# EAGLE schematic ridicideskaV4 (EAGLE 7.2.0)
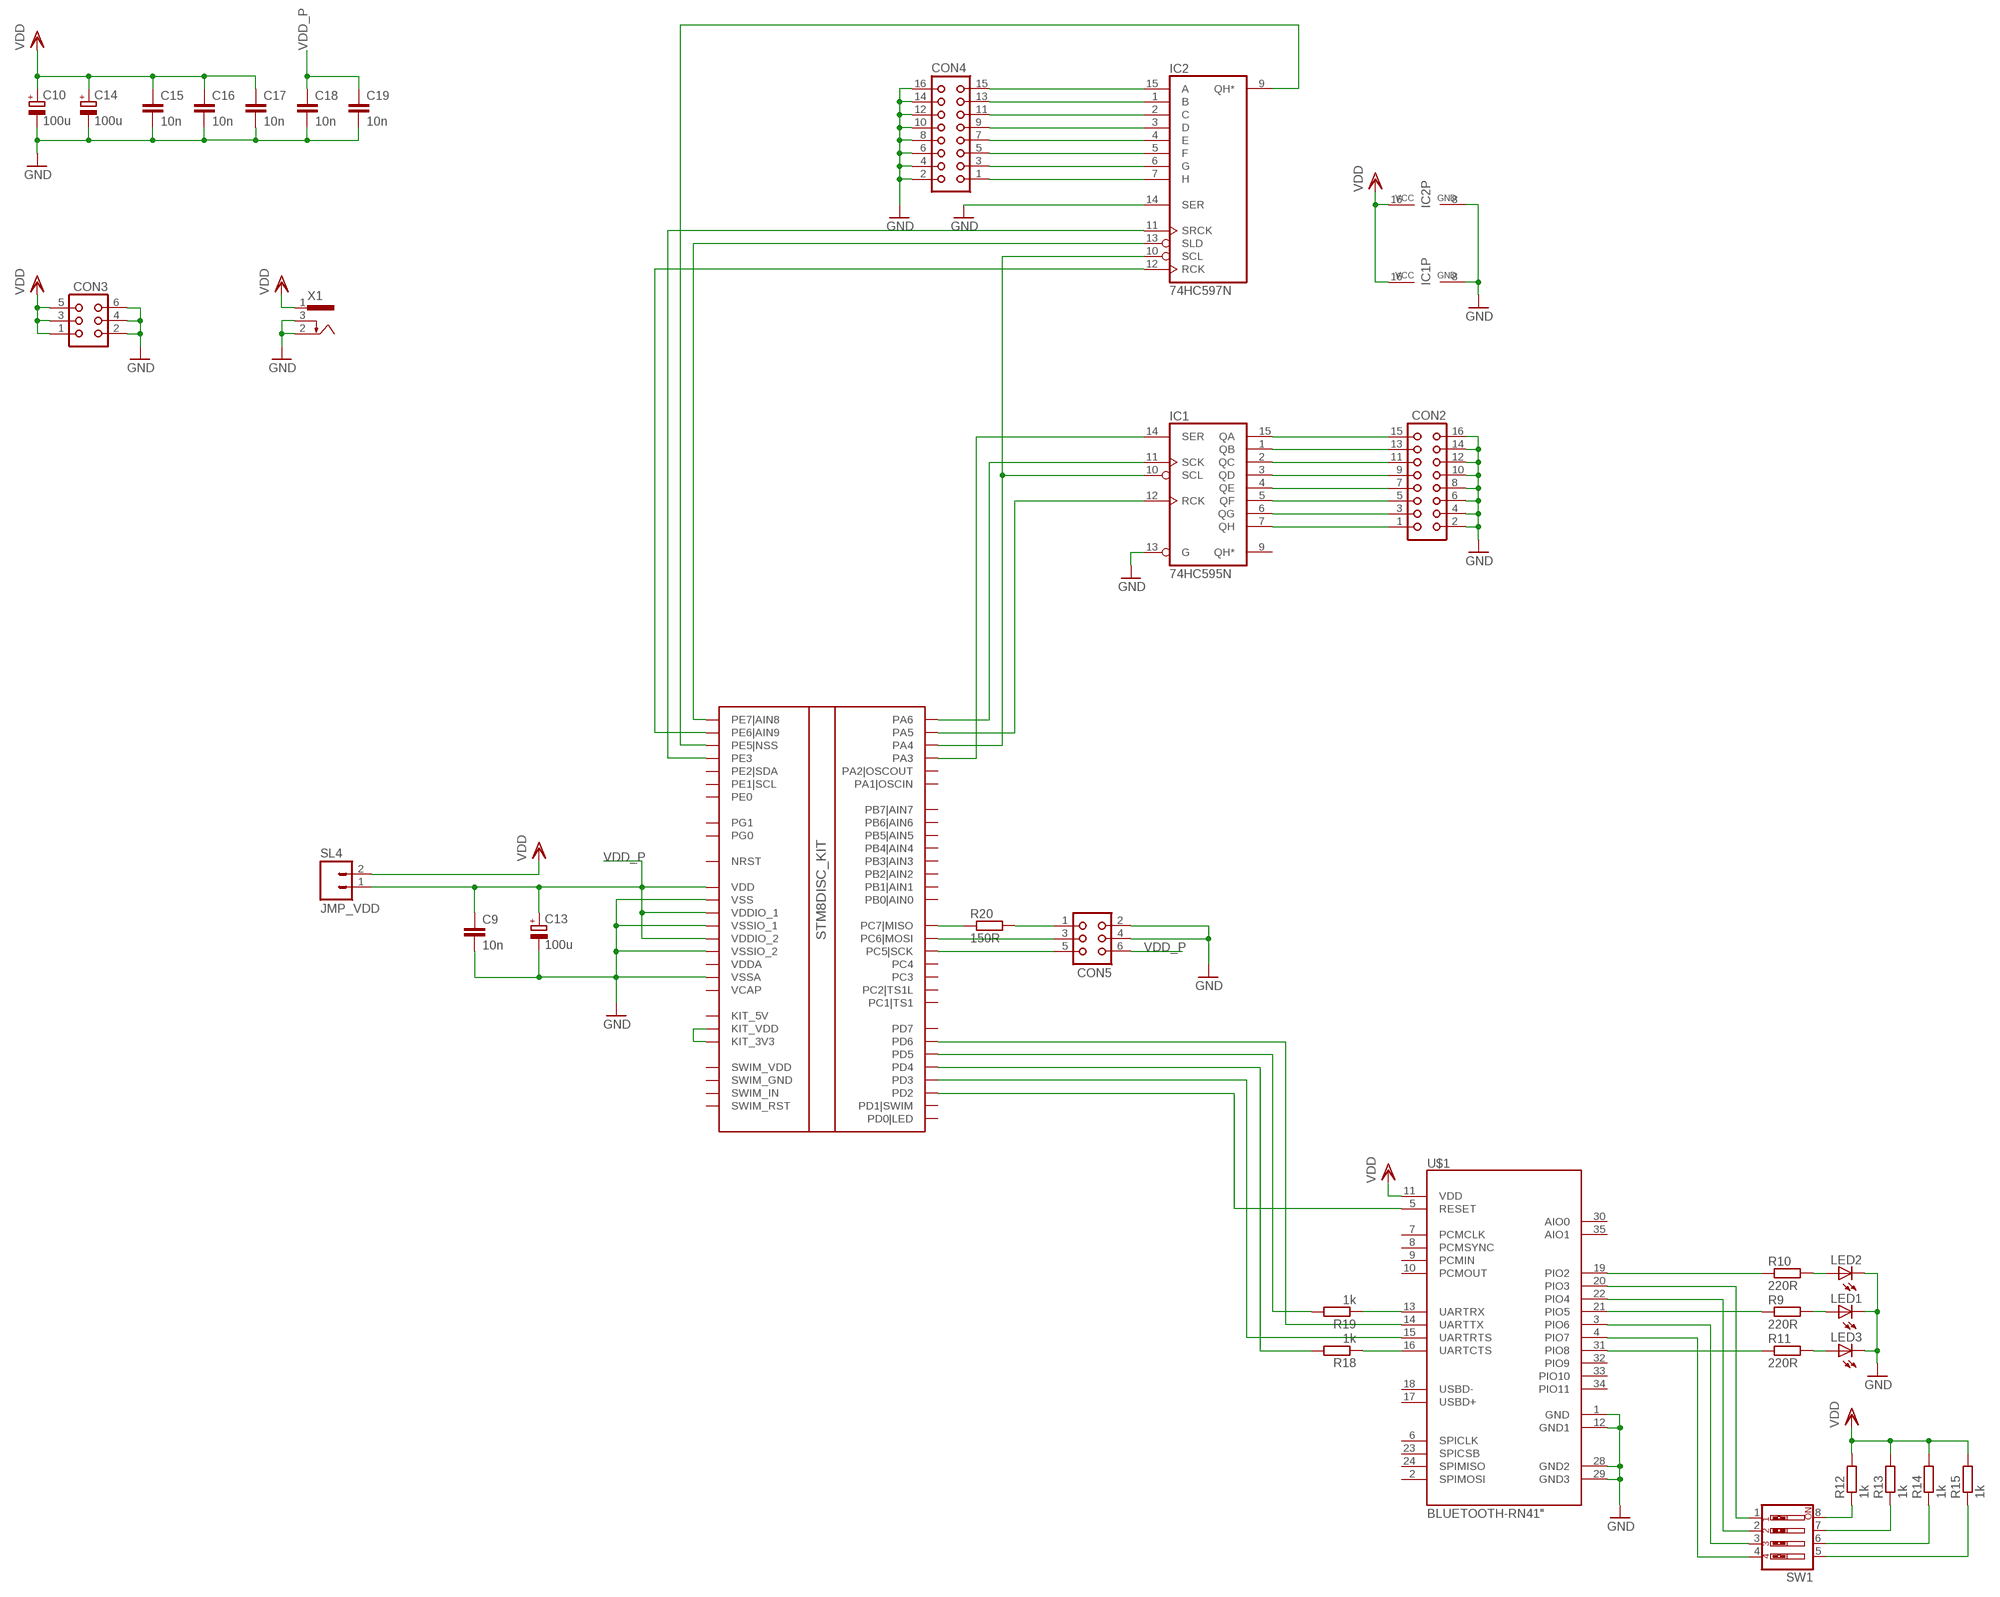
[diagram p0: schematic, sheet 1, part 1 of 2]
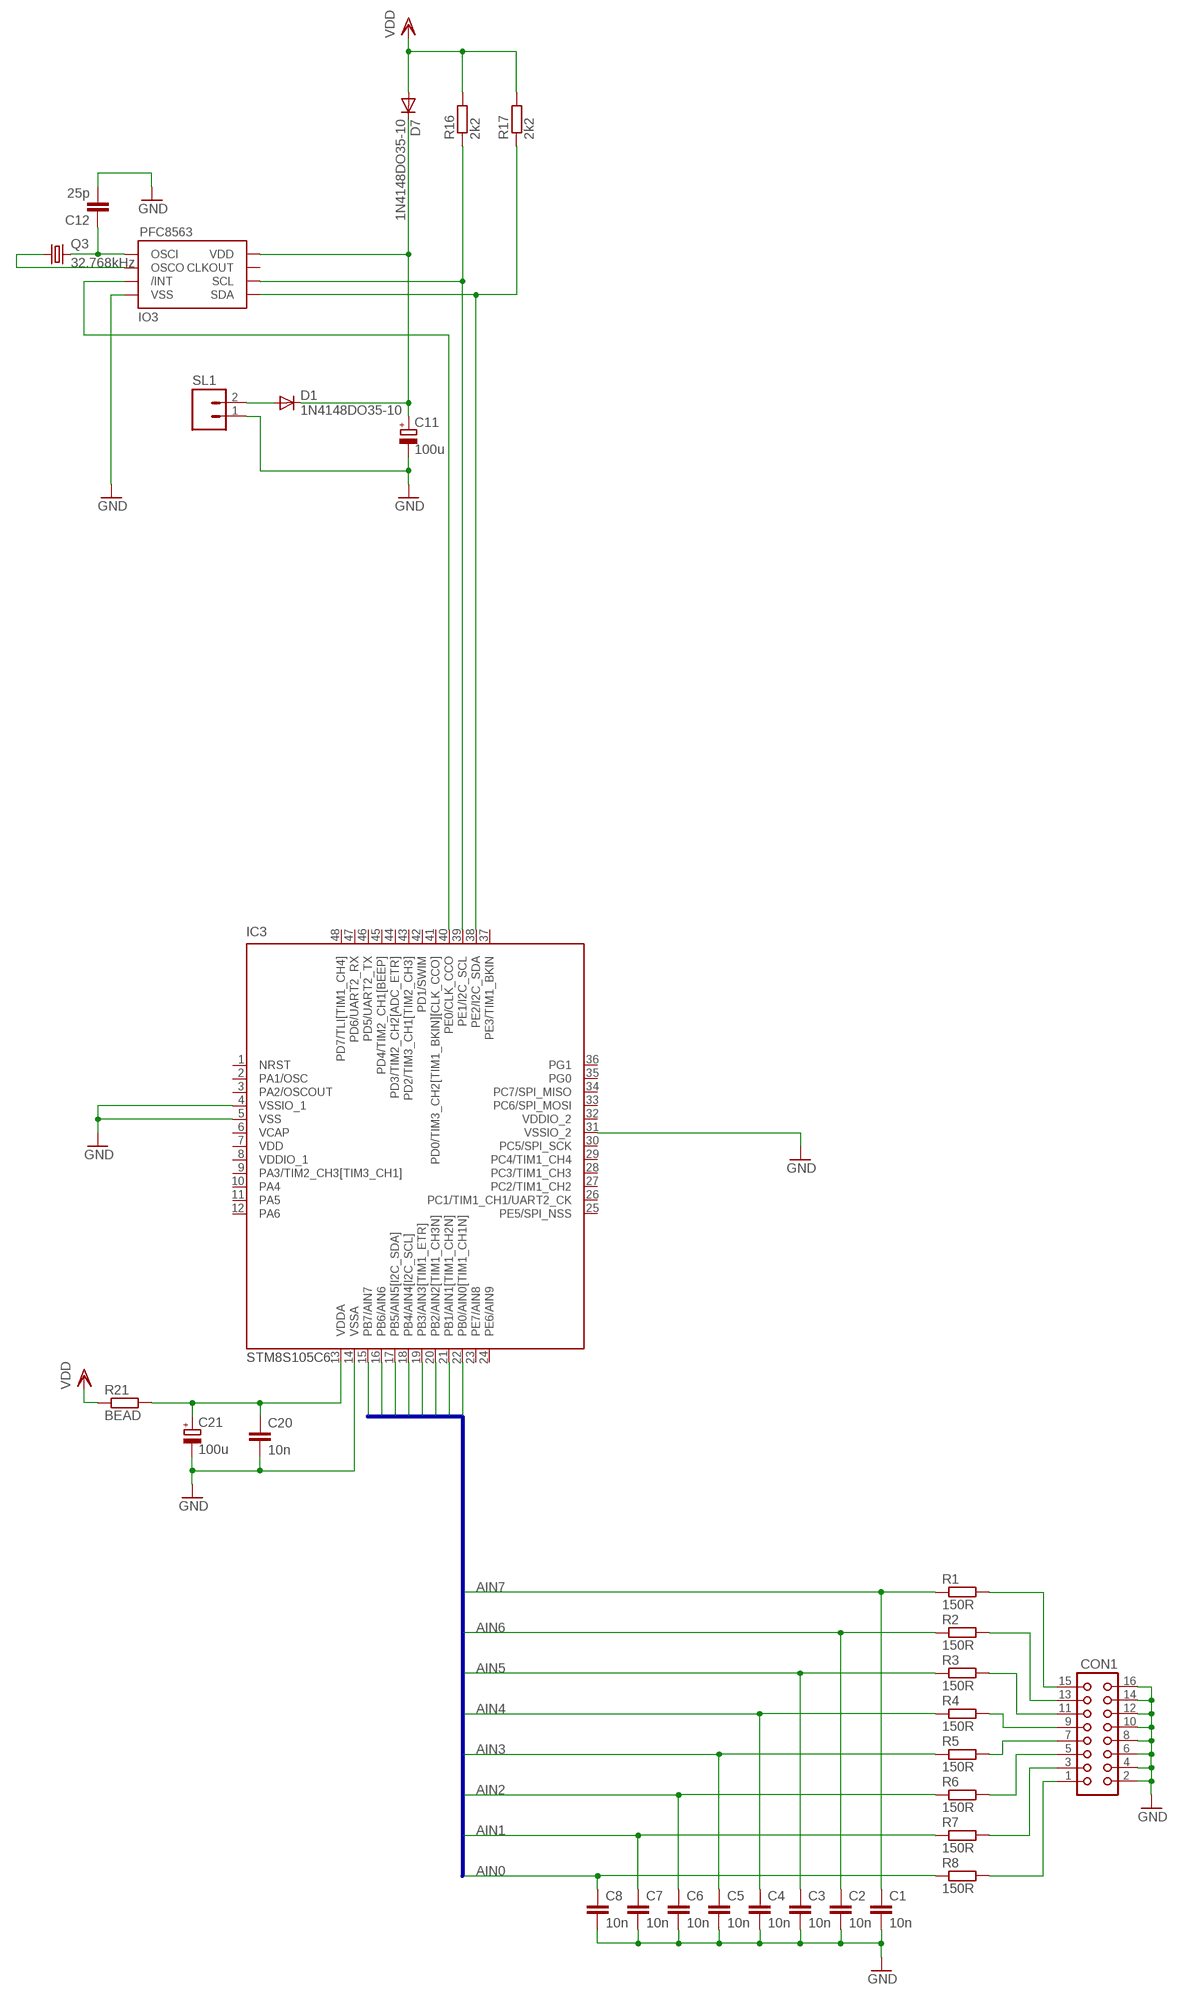
[diagram p1: schematic, sheet 1, part 2 of 2]

## Parts
C1  10n  C-EUC0805  [C0805]
C2  10n  C-EUC0805  [C0805]
C3  10n  C-EUC0805  [C0805]
C4  10n  C-EUC0805  [C0805]
C5  10n  C-EUC0805  [C0805]
C6  10n  C-EUC0805  [C0805]
C7  10n  C-EUC0805  [C0805]
C8  10n  C-EUC0805  [C0805]
C9  10n  C-EU050-045X075  [C050-045X075]
C10  100u  CPOL-EUE5-10.5  [E5-10,5]
C11  100u  CPOL-EUE5-10.5  [E5-10,5]
C12  25p  C-EUC0603  [C0603]
C13  100u  CPOL-EUE5-10.5  [E5-10,5]
C14  100u  CPOL-EUE5-10.5  [E5-10,5]
C15  10n  C-EU050-045X075  [C050-045X075]
C16  10n  C-EU050-045X075  [C050-045X075]
C17  10n  C-EUC0805  [C0805]
C18  10n  C-EUC0805  [C0805]
C19  10n  C-EUC0805  [C0805]
C20  10n  C-EUC0805  [C0805]
C21  100u  CPOL-EUSMCC  [SMC_C]
CON1  CON16  [CON16]
CON2  CON16  [CON16]
CON3  CON06  [CON06]
CON4  CON16  [CON16]
CON5  CON06  [CON06]
D1  1N4148DO35-10  [DO35-10]
D7  1N4148DO35-10  [DO35-10]
IC1  74HC595N  [DIL16]
IC2  74HC597N  [DIL16]
IC3  STM8S105C6  [LQFP48-7X7]
IO1  STM8_KIT  [STM8SDISCOVERY]
IO3  PFC8563  [SO08]
LED1  LED3MM  [LED3MM]
LED2  LED3MM  [LED3MM]
LED3  LED3MM  [LED3MM]
Q3  32.768kHz  CRYSTALTC26V  [TC26V]
R1  150R  R-EU_0207/12  [0207/12]
R2  150R  R-EU_0207/12  [0207/12]
R3  150R  R-EU_0207/12  [0207/12]
R4  150R  R-EU_0207/12  [0207/12]
R5  150R  R-EU_0207/12  [0207/12]
R6  150R  R-EU_0207/12  [0207/12]
R7  150R  R-EU_0207/12  [0207/12]
R8  150R  R-EU_0207/12  [0207/12]
R9  220R  R-EU_0207/12  [0207/12]
R10  220R  R-EU_0207/12  [0207/12]
R11  220R  R-EU_0207/12  [0207/12]
R12  1k  R-EU_0207/12  [0207/12]
R13  1k  R-EU_0207/12  [0207/12]
R14  1k  R-EU_0207/12  [0207/12]
R15  1k  R-EU_0207/12  [0207/12]
R16  2k2  R-EU_0207/12  [0207/12]
R17  2k2  R-EU_0207/12  [0207/12]
R18  1k  R-EU_0207/12  [0207/12]
R19  1k  R-EU_0207/12  [0207/12]
R20  150R  R-EU_R0805  [R0805]
R21  BEAD  R-EU_R0805  [R0805]
SL1  M02  [02P]
SL4  JMP_VDD  M02  [02P]
SW1  SW_DIP-4  [EDG-04]
U$1  BLUETOOTH-RN41"  [RN41]
X1  733980-62  [733980-62]

## Nets
AIN0: C8.1 IC3.22(PB0/AIN0[TIM1_CH1N]) R8.1
AIN1: C7.1 IC3.21(PB1/AIN1[TIM1_CH2N]) R7.1
AIN2: C6.1 IC3.20(PB2/AIN2[TIM1_CH3N]) R6.1
AIN3: C5.1 IC3.19(PB3/AIN3[TIM1_ETR]) R5.1
AIN4: C4.1 IC3.18(PB4/AIN4[I2C_SCL]) R4.1
AIN5: C3.1 IC3.17(PB5/AIN5[I2C_SDA]) R3.1
AIN6: C2.1 IC3.16(PB6/AIN6) R2.1
AIN7: C1.1 IC3.15(PB7/AIN7) R1.1
GND: C1.2 C2.2 C3.2 C4.2 C5.2 C6.2 C7.2 C8.2 C9.2 C10.- C11.- C12.2 C13.- C14.- C15.2 C16.2 C17.2 C18.2 C19.2 C20.2 C21.- CON1.2 CON1.4 CON1.6 CON1.8 CON1.10 CON1.12 CON1.14 CON1.16 CON2.2 CON2.4 CON2.6 CON2.8 CON2.10 CON2.12 CON2.14 CON2.16 CON3.2 CON3.4 CON3.6 CON4.2 CON4.4 CON4.6 CON4.8 CON4.10 CON4.12 CON4.14 CON4.16 CON5.2 CON5.4 IC1.8(GND) IC1.13(G) IC2.8(GND) IC2.14(SER) IC3.4(VSSIO_1) IC3.5(VSS) IC3.14(VSSA) IC3.31(VSSIO_2) IO1.VSS IO1.VSSA IO1.VSSIO_1 IO1.VSSIO_2 IO3.4(VSS) LED1.K(C) LED2.K(C) LED3.K(C) SL1.1 U$1.1(GND) U$1.12(GND1) U$1.28(GND2) U$1.29(GND3) X1.2 X1.3
N$1: IC1.14(SER) IO1.PA3
N$2: D1.A SL1.2
N$3: C20.1 C21.+ IC3.13(VDDA) R21.2
N$6: CON1.15 R1.2
N$7: CON1.13 R2.2
N$8: CON1.11 R3.2
N$9: CON1.9 R4.2
N$10: CON1.1 R8.2
N$11: IC1.11(SCK) IO1.PA6
N$12: IC1.10(SCL) IC2.10(SCL) IO1.PA4
N$13: IC1.12(RCK) IO1.PA5
N$14: CON2.15 IC1.15(QA)
N$15: CON2.13 IC1.1(QB)
N$16: CON2.11 IC1.2(QC)
N$17: CON2.9 IC1.3(QD)
N$18: CON2.7 IC1.4(QE)
N$19: CON2.5 IC1.5(QF)
N$20: CON2.3 IC1.6(QG)
N$21: CON2.1 IC1.7(QH)
N$22: IC2.13(SLD) IO1.PE7(PE7|AIN8)
N$23: IC3.38(PE2/I2C_SDA) IO3.5(SDA) R17.1
N$24: IC2.9(QH*) IO1.PE5(PE5|NSS)
N$25: CON1.3 R7.2
N$28: IC3.39(PE1/I2C_SCL) IO3.6(SCL) R16.1
N$29: C11.+ D1.C D7.C IO3.8(VDD)
N$30: IC3.40(PE0/CLK_CCO) IO3.3(/INT)
N$31: CON4.15 IC2.15(A)
N$32: CON4.13 IC2.1(B)
N$33: CON4.11 IC2.2(C)
N$34: CON4.9 IC2.3(D)
N$35: CON4.7 IC2.4(E)
N$36: CON4.5 IC2.5(F)
N$37: CON4.3 IC2.6(G)
N$38: CON4.1 IC2.7(H)
N$39: C12.1 IO3.1(OSCI) Q3.2
N$40: IO3.2(OSCO) Q3.1
N$42: R19.1 U$1.13(UARTRX)
N$45: CON1.5 R6.2
N$46: CON1.7 R5.2
N$47: IO1.PD5 R19.2
N$48: IO1.PD6 U$1.14(UARTTX)
N$49: LED1.A R9.2
N$50: R9.1 U$1.21(PIO5)
N$51: R10.1 U$1.19(PIO2)
N$52: LED2.A R10.2
N$53: SW1.1 U$1.20(PIO3)
N$54: SW1.2 U$1.22(PIO4)
N$55: SW1.3 U$1.3(PIO6)
N$56: SW1.4 U$1.4(PIO7)
N$57: R11.1 U$1.31(PIO8)
N$58: LED3.A R11.2
N$59: R12.1 SW1.8
N$60: R13.1 SW1.7
N$61: R14.1 SW1.6
N$62: R15.1 SW1.5
N$63: IO1.PD4 R18.2
N$64: IO1.PD3 U$1.15(UARTRTS)
N$65: R18.1 U$1.16(UARTCTS)
N$66: IC2.12(RCK) IO1.PE6(PE6|AIN9)
N$67: IC2.11(SRCK) IO1.PE3
N$68: IO1.KIT_3V3 IO1.KIT_VDD
N$69: IO1.PD2 U$1.5(RESET)
N$70: IO1.PC7(PC7|MISO) R20.1
N$71: CON5.1 R20.2
N$72: CON5.3 IO1.PC6(PC6|MOSI)
N$73: CON5.5 IO1.PC5(PC5|SCK)
VDD: C10.+ C14.+ C15.1 C16.1 C17.1 CON3.1 CON3.3 CON3.5 D7.A IC1.16(VCC) IC2.16(VCC) R12.2 R13.2 R14.2 R15.2 R16.2 R17.2 R21.1 SL4.2 U$1.11(VDD) X1.1
VDD_P: C9.1 C13.+ C18.1 C19.1 CON5.6 IO1.VDD IO1.VDDIO_1 IO1.VDDIO_2 SL4.1
Unconnected: IC1.9(QH*) IC3.1(NRST) IC3.2(PA1/OSC) IC3.3(PA2/OSCOUT) IC3.9(PA3/TIM2_CH3[TIM3_CH1]) IC3.10(PA4) IC3.11(PA5) IC3.12(PA6) IC3.23(PE7/AIN8) IC3.24(PE6/AIN9) IC3.25(PE5/SPI_NSS) IC3.26(PC1/TIM1_CH1/UART2_CK) IC3.27(PC2/TIM1_CH2) IC3.28(PC3/TIM1_CH3) IC3.29(PC4/TIM1_CH4) IC3.30(PC5/SPI_SCK) IC3.33(PC6/SPI_MOSI) IC3.34(PC7/SPI_MISO) IC3.35(PG0) IC3.36(PG1) IC3.37(PE3/TIM1_BKIN) IC3.41(PD0/TIM3_CH2[TIM1_BKIN][CLK_CCO]) IC3.42(PD1/SWIM) IC3.43(PD2/TIM3_CH1[TIM2_CH3]) IC3.44(PD3/TIM2_CH2[ADC_ETR]) IC3.45(PD4/TIM2_CH1[BEEP]) IC3.46(PD5/UART2_TX) IC3.47(PD6/UART2_RX) IC3.48(PD7/TLI[TIM1_CH4]) IO1.KIT_5V IO1.NRST IO1.PA1(PA1|OSCIN) IO1.PA2(PA2|OSCOUT) IO1.PB0(PB0|AIN0) IO1.PB1(PB1|AIN1) IO1.PB2(PB2|AIN2) IO1.PB3(PB3|AIN3) IO1.PB4(PB4|AIN4) IO1.PB5(PB5|AIN5) IO1.PB6(PB6|AIN6) IO1.PB7(PB7|AIN7) IO1.PC1(PC1|TS1) IO1.PC2(PC2|TS1L) IO1.PC3 IO1.PC4 IO1.PD0(PD0|LED) IO1.PD1(PD1|SWIM) IO1.PD7 IO1.PE0 IO1.PE1(PE1|SCL) IO1.PE2(PE2|SDA) IO1.PG0 IO1.PG1 IO1.SWIM_GND IO1.SWIM_IN IO1.SWIM_RST IO1.SWIM_VDD IO1.VCAP IO1.VDDA IO3.7(CLKOUT) U$1.2(SPIMOSI) U$1.6(SPICLK) U$1.7(PCMCLK) U$1.8(PCMSYNC) U$1.9(PCMIN) U$1.10(PCMOUT) U$1.17(USBD+) U$1.18(USBD-) U$1.23(SPICSB) U$1.24(SPIMISO) U$1.30(AIO0) U$1.32(PIO9) U$1.33(PIO10) U$1.34(PIO11) U$1.35(AIO1)

## Buses
AIN[0..7]

## Power pins joined to a net without a drawn wire
VCAP: IC3.6(VCAP)
VDD: IC3.7(VDD)
VDDIO_1: IC3.8(VDDIO_1)
VDDIO_2: IC3.32(VDDIO_2)

## Library data of the parts
C1-C9 C12 C15-C20 = rcl:C-EU: CAPACITOR, European symbol
C10 C11 C13 C14 C21 = resistor:CPOL-EU: POLARIZED CAPACITOR, European symbol
CON1 CON2 CON4 = con-harting:CON16: CONNECTOR; OC_FARNELL: unknown; OC_NEWARK: unknown
CON3 CON5 = con-harting:CON06: CONNECTOR; OC_FARNELL: unknown; OC_NEWARK: unknown
D1 D7 = diode:1N4148: DIODE high speed (Philips)
IC1 = 74xx-eu:74*595: 8-bit SHIFT REGISTER, output latch
IC2 = 74xx-eu:74*597: 8-bit SHIFT REGISTER, input latch
IC3 = st-microelectronics:STM8S105C: Access line, 16 MHz STM8S 8-bit MCU up to 32 Kbytes Flash, integrated EEPROM,10-bit ADC, timers, UART, SPI, I²C Source: Data sheet <http://www.st.com/stonline/products/literature/ds/14771/stm8s105c4.pdf>; MPN: STM8S105C6T6; OC_FARNELL: 1706222; OC_NEWARK: 09R6033
IO1 = atypPouzdra:STM8_KIT
IO3 = atypPouzdra:PFC8563
LED1-LED3 = led:LED: LED OSRAM: - CHIPLED LG R971, LG N971, LY N971, LG Q971, LY Q971, LO R971, LY R971 LH N974, LH R974 LS Q976, LO Q976, LY Q976 LO Q996 - Hyper CHIPLED LW Q18S LB Q993, LB Q99A, LB R99A - SideLED LS A670, LO A670, LY A670, LG A670, LP A670 LB A673, LV A673, LT A673, LW A673 LH A674 LY A675 LS A676, LA A676, LO A676, LY A676, LW A676 LS A679, LY A679, LG A679 - Hyper Micro SIDELED® LS Y876, LA Y876, LO Y876, LY Y876 LT Y87S - SmartLED LW L88C, LW L88S LB L89C, LB L89S, LG L890 LS L89K, LO L89K, LY L89K LS L896, LA L896, LO L896, LY L896 - TOPLED LS T670, LO T670, LY T670, LG T670, LP T670 LSG T670, LSP T670, LSY T670, LOP T670, LYG T670 LG T671, LOG T671, LSG T671 LB T673, LV T673, LT T673, LW T673 LH T674 LS T676, LA T676, LO T676, LY T676, LB T676, LH T676, LSB T676, LW T676 LB T67C, LV T67C, LT T67C, LS T67K, LO T67K, LY T67K, LW E67C LS E67B, LA E67B, LO E67B, LY E67B, LB E67C, LV E67C, LT E67C LW T67C LS T679, LY T679, LG T679 LS T770, LO T770, LY T770, LG T770, LP T770 LB T773, LV T773, LT T773, LW T773 LH T774 LS E675, LA E675, LY E675, LS T675 LS T776, LA T776, LO T776, LY T776, LB T776 LHGB T686 LT T68C, LB T68C - Hyper Mini TOPLED® LB M676 - Mini TOPLED Santana® LG M470 LS M47K, LO M47K, LY M47K Source: http://www.osram.convergy.de LUXEON: - LUMILED® LXK2-PW12-R00, LXK2-PW12-S00, LXK2-PW14-U00, LXK2-PW14-V00 LXK2-PM12-R00, LXK2-PM12-S00, LXK2-PM14-U00 LXK2-PE12-Q00, LXK2-PE12-R00, LXK2-PE12-S00, LXK2-PE14-T00, LXK2-PE14-U00 LXK2-PB12-K00, LXK2-PB12-L00, LXK2-PB12-M00, LXK2-PB14-N00, LXK2-PB14-P00, LXK2-PB14-Q00 LXK2-PR12-L00, LXK2-PR12-M00, LXK2-PR14-Q00, LXK2-PR14-R00 LXK2-PD12-Q00, LXK2-PD12-R00, LXK2-PD12-S00 LXK2-PH12-R00, LXK2-PH12-S00 LXK2-PL12-P00, LXK2-PL12-Q00, LXK2-PL12-R00 Source: www.luxeon.com KINGBRIGHT: KA-3528ASYC Source: www.kingbright.com
Q3 = crystal:CRYSTAL: CRYSTAL; OC_FARNELL: unknown; OC_NEWARK: unknown
R1-R21 = rcl:R-EU_: RESISTOR, European symbol
SL1 SL4 = con-amp-quick:M02: AMP QUICK CONNECTOR; OC_FARNELL: unknown; OC_NEWARK: unknown
SW1 = special:SW_DIP-4: DIP SWITCH
U$1 = SparkFun-RF:BLUETOOTH-RN41: Bluetooth SMD module
X1 = con-conrad:73398?: FEMALE PRINT CONNECTOR Niedervolt-Steckverbinder Distributor Conrad